# Altium schematic sheet Analog Front-End.SchDoc
size A4; SheetNumber: 3; SheetTotal: 5
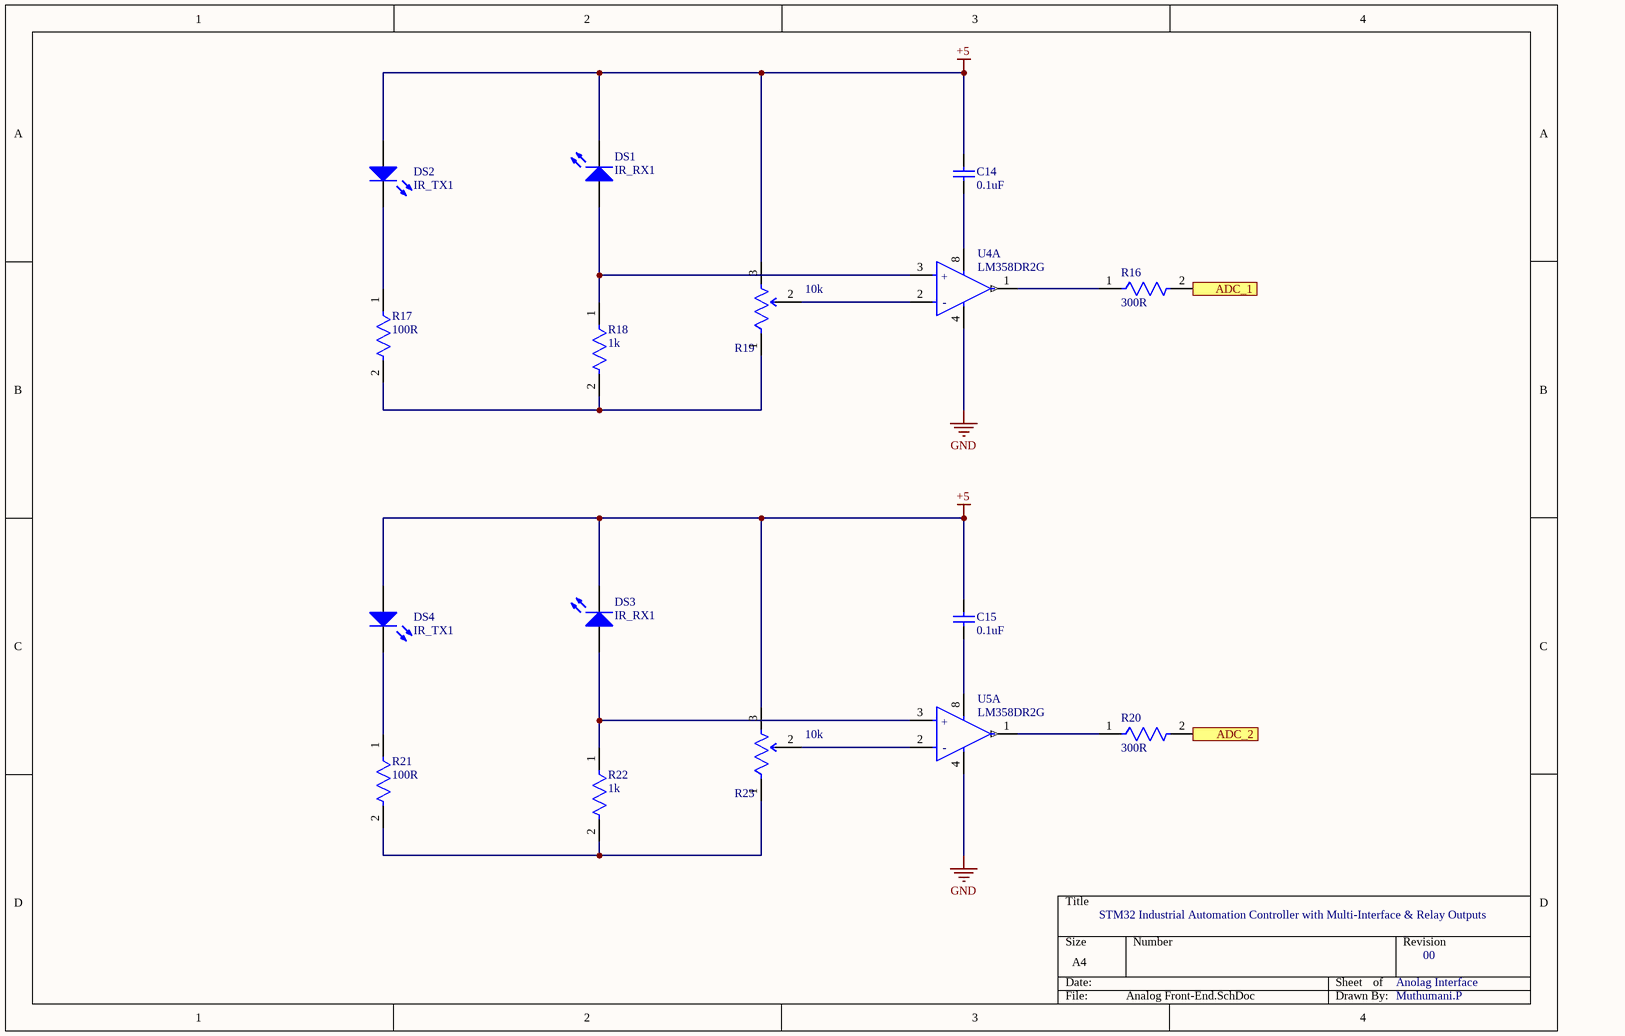
[diagram p0: Analog Front-End.SchDoc]

## Parts
C14  0.1uF  [CAPC2013X145X50NL20T25]
C15  0.1uF  [CAPC2013X145X50NL20T25]
DS1  IR_RX1  [VISH-TSAL6200]
DS2  IR_TX1  [VISH-TSAL6200]
DS3  IR_RX1  [VISH-TSAL6200]
DS4  IR_TX1  [VISH-TSAL6200]
R16  300R  [FP-AC1206-MFG]
R17  100R  [FP-AC1206-MFG]
R18  1k  [FP-AC1206-MFG]
R19  10k  [FP-3296W-MFG]
R20  300R  [FP-AC1206-MFG]
R21  100R  [FP-AC1206-MFG]
R22  1k  [FP-AC1206-MFG]
R23  10k  [FP-3296W-MFG]
U4  LM358DR2G  [FP-751-07-IPC_C]  (part A of 2)
U5  LM358DR2G  [FP-751-07-IPC_C]  (part A of 2)

## Ports
ADC_1 (out, see MCU, Relays & USB[3B]), ADC_2 (out, see MCU, Relays & USB[3C])

## Nets
+5: C14.1 C15.1 DS1.2(K) DS2.1(A) DS3.2(K) DS4.1(A) R19.3(CW) R23.3(CW)
GND: U4.4(VEE/GND) U5.4(VEE/GND)
ADC_1: R16.2 ; port ADC_1
ADC_2: R20.2 ; port ADC_2
NetC14_2: C14.2 U4.8(VCC)
NetC15_2: C15.2 U5.8(VCC)
NetDS1_1: DS1.1(A) R18.1 U4.3(INPUT_A+)
NetDS2_2: DS2.2(K) R17.1
NetDS3_1: DS3.1(A) R22.1 U5.3(INPUT_A+)
NetDS4_2: DS4.2(K) R21.1
NetR16_1: R16.1 U4.1(OUTPUT_A)
NetR17_2: R17.2 R18.2 R19.1(CCW)
NetR19_2: R19.2(WIPER) U4.2(INPUT_A-)
NetR20_1: R20.1 U5.1(OUTPUT_A)
NetR21_2: R21.2 R22.2 R23.1(CCW)
NetR23_2: R23.2(WIPER) U5.2(INPUT_A-)

## Notes on the sheet
- STM32 Industrial Automation Controller with Multi-Interface & Relay Outputs
- Anolag Interface
- 00
- Muthumani.P
- (in symbol CMP-1310-00291-2, part A) +; -

## Library data of the parts
C14 C15 = CMP-2007-01227-1: Manufacturer: Kemet; Part Number: C0805S104K5RACTU
DS1-DS4 = CMP-2000-07327-1: High Power Infrared Emitting Diode, GaAlAs, MQW, 1.35 V, 100 mA, -40 to 85 degC, 2-Pin THD, RoHS, Bulk; Manufacturer: Vishay; Lum Intensity: 500mW/srmcd; Product Depth (mm): 5.8mm; Type: IrLED; Luminous Intensity: 500mW/sr; Forward Voltage: 3V; Shape Type: Circular; Peak Wavelength: 950nm; Rad Hardened: No; Product Height (mm): 8.7mm; Number of  Elements: 1; Forward Current: 100mA; High Brightness: Yes; Reverse Voltage: 5V; DELETED: Compliant; Power Dissipation: 160W; Viewing Angle: 34deg; Lens Type: Colored; Packaging: Bulk; Lens Dimensions: 5x5x7.7mm; Package Reference: TSAL6200; Chip Material: GaAlAs; Package Description: 2-Pin Through Hole Device, Dia 5.8 mm, Pitch 2.54 mm; Main Category: IrLED; Manufacturer URL: http://www.vishay.com/; Product Length (mm): 5.8mm; Datasheet URL: http://www.vishay.com/docs/81010/tsal6200.pdf; Operating Temperature Classification: Industrial; Package Type: T-13/4; Pin Count: 2; Mounting: ThroughHole; Mounting Technology: ThroughHole; Test Current (It): 100mA; Datasheet Version: Rev. 2.4, 03/2014; Operating Temp Range: -40Cto85C
R16-R18 R20-R22 = CMP-03412-006130-1: RES SMD 6.2K OHM 5% 1/4W 1206; Manufacturer: Yageo; Manufacturer Part Number: AC1206JR-076K2L; Resistance: 6.2KΩ; Tolerance: 0.05; Voltage Rating: 200V; Automotive Grade: Grade 0; Value: 6.2KΩ; Power Rating: 0.25W; Temperature: -55°C to +155°C; Octopart: https://octopart.com/ac1206jr-076k2l-yageo-30511322; Footprint Url: http://www.yageo.com/exep/pages/download/literatures/PYu-R_Mount_10.pdf; Composition: Thick Film; Device Class L2: Resistors; Temperature Range High: +155°C; Series: AC; Mouser Description: Thick Film Resistors - SMD 1/4W 6.2K ohm 5% AEC-Q200; Device Class L1: Passive Components; Temperature Range Low: -55°C; Height: 0.65mm; Ipc Land Pattern Name: RESC310160X55; Device Class L3: Chip SMD Resistors; ComponentLink2Description: Datasheet; Category: Res; RoHS: TRUE; Automotive: Yes; ComponentLink2URL: http://www.yageo.com/NewPortal/yageodocoutput?fileName=/pdf/R-Chip/PYu-AC_51_RoHS_L_6.pdf; Lead Free: Yes; Package: AC1206; Digikey Description: RES SMD 6.2K OHM 5% 1/4W 1206
R19 R23 = CMP-1747-00001-8: TRIMMER 10K OHM 0.5W PC PIN TOP; Number of Turns: 25; Tolerance: 10%; Resistance: 10kR; Max Power Dissipation: 500mW; Temperature Coefficient: 100ppm/°C; Insulation Resistance: 1GR; Min Operating Temperature: -55°C; Resistor Type: Cermet; Series: 3296; Color: Blue; Mount: Through Hole; Taper: Linear; Radiation Hardening: No; RoHS Compliant: Yes; Width: 9.53mm; Resistance Tolerance: 10%; Contact Plating: Tin; Military Standard: Not; Package Quantity: 50; Weight: 0.03oz; Lead Free: Lead Free; Power Rating: 500mW; Termination: Pin; Technology: CERMET; Max Operating Temperature: 125°C; Packaging: Rail/Tube; Length: 9.53mm; Depth: 4.83mm; Height: 11.55mm; Reach SVHC Compliant: Yes
U4 U5 = CMP-1310-00291-2: IC OPAMP GP 2 CIRCUIT 8SOIC; Gain Bandwidth Product: 1MHz; Number of Circuits: 2; Min Supply Voltage: 3V; Slew Rate: 0.6V/µs; Max Dual Supply Voltage: 16V; Common Mode Rejection Ratio: 65dB; Input Bias Current: 250nA; Min Dual Supply Voltage: 1.5V; Dual Supply Voltage: 9V; Operating Supply Current: 1.5mA; Output Current: 40mA; Input Offset Voltage (Vos): 7mV; Nominal Supply Current: 1.2mA; Voltage Gain: 100dB; Max Supply Voltage: 32V; Width: 4mm; Number of Pins: 8; Min Operating Temperature: 0°C; REACH SVHC: No SVHC; Contact Plating: Tin; Lead Free: Lead Free; Halogen Free: Halogen Free; Power Supply Rejection Ratio (PSRR): 65dB; Operating Supply Voltage: 16V; Package Quantity: 2500; Max Operating Temperature: 70°C; Case/Package: SOIC; Height: 1.5mm; Packaging: Tape and Reel; Radiation Hardening: No; Number of Channels: 2; Bandwidth: 1MHz; Length: 5mm; Number of Elements: 2; Number of Amplifiers: 2; Output Current per Channel: 40mA